# Altium schematic sheet IDD_measurement.SchDoc: IDD measurement / MFX (Multi Function eXpander)
size A3; Date: 3/31/2015; Author: P.A.; CompanyName: STMicroelectronics; Organization: Microcontrollers Division; Address1: 12, Rue Jules HOROWITZ; Address2: 38019 Grenoble; Address3: FRANCE; DocumentNumber: MB1261; Revision: B.01; SheetNumber: 10; SheetTotal: 15; Project: STM32L496G-DISCO
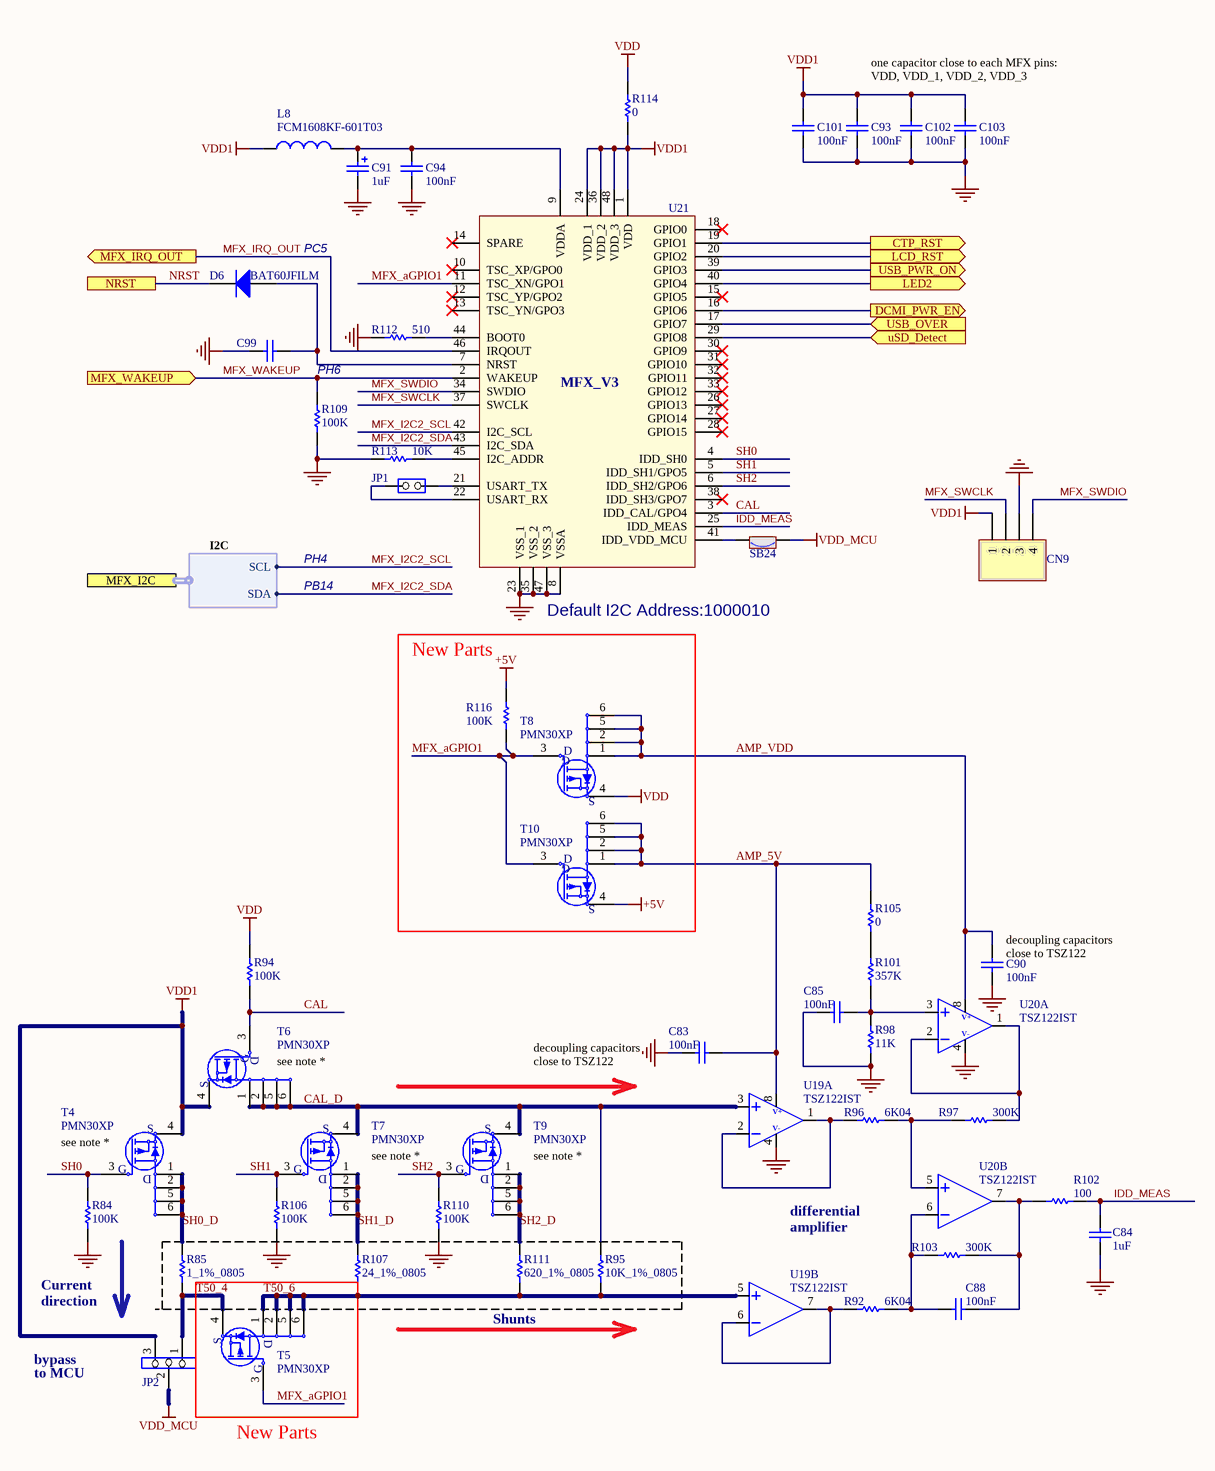
[diagram p0: IDD_measurement.SchDoc]

## Parts
C83  value 100nF  [0603C]  (hidden comment: CC0603KRX7R7BB104)
C84  value 1uF  [0603C]  (hidden comment: CC0603KRX5R7BB105)
C85  value 100nF  [0603C]  (hidden comment: CC0603KRX7R7BB104)
C88  value 100nF  [0603C]  (hidden comment: CC0603KRX7R7BB104)
C90  value 100nF  [0603C]  (hidden comment: CC0603KRX7R7BB104)
C91  value 1uF  [TAN-A]  (hidden comment: TAJA105K016R)
C93  value 100nF  [0603C]  (hidden comment: CC0603KRX7R7BB104)
C94  value 100nF  [0603C]  (hidden comment: CC0603KRX7R7BB104)
C99  (no value)  [0603C]
C101  value 100nF  [0603C]  (hidden comment: CC0603KRX7R7BB104)
C102  value 100nF  [0603C]  (hidden comment: CC0603KRX7R7BB104)
C103  value 100nF  [0603C]  (hidden comment: CC0603KRX7R7BB104)
CN9  (no value)  [HDR_1X4_2R54]
D6  BAT60JFILM  [SOD-323]
JP1  (no value)  [SIP2]
JP2  3 PIN Jumper  [SIP3]  (value not drawn)
L8  FCM1608KF-601T03  [0603L]
R84  value 100K  [0603R]  (hidden comment: RC0603FR-07100KL)
R85  1_1%_0805  [0805R]
R92  value 6K04  [0603R]  (hidden comment: RC0603FR-076K04L)
R94  value 100K  [0603R]  (hidden comment: RC0603FR-07100KL)
R95  10K_1%_0805  [0805R]
R96  value 6K04  [0603R]  (hidden comment: RC0603FR-076K04L)
R97  value 300K  [0603R]  (hidden comment: RC0603FR-07300KL)
R98  value 11K  [0603R]  (hidden comment: RC0603FR-0711KL)
R101  value 357K  [0603R]  (hidden comment: RC0603FR-07357KL)
R102  value 100  [0603R]  (hidden comment: RC0603JR-07100RL)
R103  value 300K  [0603R]  (hidden comment: RC0603FR-07300KL)
R105  value 0  [0603R]  (hidden comment: RC0603JR-070RL)
R106  value 100K  [0603R]  (hidden comment: RC0603FR-07100KL)
R107  24_1%_0805  [0805R]
R109  value 100K  [0603R]  (hidden comment: RC0603FR-07100KL)
R110  value 100K  [0603R]  (hidden comment: RC0603FR-07100KL)
R111  620_1%_0805  [0805R]
R112  value 510  [0603R]  (hidden comment: RC0603FR-07510RL)
R113  value 10K  [0603R]  (hidden comment: RC0603FR-0710KL)
R114  value 0  [0603R]  (hidden comment: RC0603JR-070RL)
R116  value 100K  [0603R]  (hidden comment: RC0603FR-07100KL)
SB24  Solder Bridge ON  [SB_0603]  (value not drawn)
T4  PMN30XP  [MOS_SOT23-6L]
T5  PMN30XP  [MOS_SOT23-6L]
T6  PMN30XP  [MOS_SOT23-6L]
T7  PMN30XP  [MOS_SOT23-6L]
T8  PMN30XP  [MOS_SOT23-6L]
T9  PMN30XP  [MOS_SOT23-6L]
T10  PMN30XP  [MOS_SOT23-6L]
U19  TSZ122IST  [miniSO8]  (parts A,B of 2)
U20  TSZ122IST  [miniSO8]  (parts A,B of 2)
U21  STM32L152CCT6  [LQFP48_0R5_9X9]  (value not drawn)

## Blocks framed on the sheet
New Parts: R116 T8 T10

## Ports
CTP_RST (out), DCMI_PWR_EN (out), LCD_RST (out), LED2 (out), MFX_I2C (harness I2C), MFX_IRQ_OUT (out), MFX_WAKEUP (in), NRST, USB_OVER (in), USB_PWR_ON (out), uSD_Detect (in)

## Harnesses
I2C: SDA, SCL

## Nets
+5V: R116.2 T10.4(S)
GND: C83.1 C84.2 C85.1 C90.2 C91.2 C93.2 C94.2 C99.1 C101.2 C102.2 C103.2 CN9.3 R84.1 R98.2 R106.1 R109.1 R110.1 R112.2 R113.2 U19.4 U20.4 U21.8(VSSA) U21.23(VSS_1) U21.35(VSS_2) U21.47(VSS_3)
VDD: R94.2 R114.1 T8.4(S)
VDD1: C93.1 C101.1 C102.1 C103.1 CN9.1 JP2.3 L8.1 R114.2 T4.4(S) T6.4(S) U21.1(VDD) U21.24(VDD_1) U21.36(VDD_2) U21.48(VDD_3)
VDD_MCU: JP2.2 SB24.1
AMP_5V: C83.2 R105.2 T10.1(S) T10.2(S) T10.5(D) T10.6(D) U19.8
AMP_VDD: C90.1 T8.1(S) T8.2(S) T8.5(D) T8.6(D) U20.8
CAL: R94.1 T6.3(G) U21.3(IDD_CAL/GPO4)
CAL_D: R95.2 T6.1(S) T6.2(S) T6.5(D) T6.6(D) T7.4(S) T9.4(S) U19.3
CTP_RST: U21.19(GPIO1) ; port CTP_RST
DCMI_PWR_EN: U21.16(GPIO6) ; port DCMI_PWR_EN
IDD_MEAS: C84.1 R102.1 U21.25(IDD_MEAS)
LCD_RST: U21.20(GPIO2) ; port LCD_RST
LED2: U21.40(GPIO4) ; port LED2
MFX_aGPIO1: R116.1 T5.3(G) T8.3(G) T10.3(G) U21.11(TSC_XN/GPO1)
MFX_I2C2_SCL: U21.42(I2C_SCL) ; port MFX_I2C.SCL
MFX_I2C2_SDA: U21.43(I2C_SDA) ; port MFX_I2C.SDA
MFX_IRQ_OUT: U21.46(IRQOUT) ; port MFX_IRQ_OUT
MFX_SWCLK: CN9.2 U21.37(SWCLK)
MFX_SWDIO: CN9.4 U21.34(SWDIO)
MFX_WAKEUP: R109.2 U21.2(WAKEUP) ; port MFX_WAKEUP
NRST: D6.2(K) ; port NRST
SH0: R84.2 T4.3(G) U21.4(IDD_SH0)
SH0_D: R85.2 T4.1(S) T4.2(S) T4.5(D) T4.6(D)
SH1: R106.2 T7.3(G) U21.5(IDD_SH1/GPO5)
SH1_D: R107.2 T7.1(S) T7.2(S) T7.5(D) T7.6(D)
SH2: R110.2 T9.3(G) U21.6(IDD_SH2/GPO6)
SH2_D: R111.2 T9.1(S) T9.2(S) T9.5(D) T9.6(D)
T50_4: JP2.1 R85.1 T5.4(S)
T50_6: R95.1 R107.1 R111.1 T5.1(S) T5.2(S) T5.5(D) T5.6(D) U19.5
USB_OVER: U21.17(GPIO7) ; port USB_OVER
USB_PWR_ON: U21.39(GPIO3) ; port USB_PWR_ON
uSD_Detect: U21.29(GPIO8) ; port uSD_Detect
NetC85_2: C85.2 R98.1 R101.2 U20.3
NetC88_1: C88.1 R92.1 R103.1 U20.6
NetC88_2: C88.2 R102.2 R103.2 U20.7
NetC91_1: C91.1 C94.1 L8.2 U21.9(VDDA)
NetC99_2: C99.2 D6.1(A) U21.7(NRST)
NetJP1_1: JP1.1(COMMON) U21.22(USART_RX)
NetJP1_2: JP1.2(NO) U21.21(USART_TX)
NetR92_2: R92.2 U19.6 U19.7
NetR96_1: R96.1 R97.1 U20.5
NetR96_2: R96.2 U19.1 U19.2
NetR97_2: R97.2 U20.1 U20.2
NetR101_1: R101.1 R105.1
NetR112_1: R112.1 U21.44(BOOT0)
NetR113_1: R113.1 U21.45(I2C_ADDR)
NetSB24_2: SB24.2 U21.41(IDD_VDD_MCU)

Not connected (* = marked no-connect by the designer): U21 10(TSC_XP/GPO0)* 12(TSC_YP/GPO2)* 13(TSC_YN/GPO3)* 14(SPARE)* 15(GPIO5)* 18(GPIO0)* 26(GPIO13)* 27(GPIO14)* 28(GPIO15)* 30(GPIO9)* 31(GPIO10)* 32(GPIO11)* 33(GPIO12)* 38(IDD_SH3/GPO7)*

## Notes on the sheet
- one capacitor close to each MFX pins: VDD, VDD_1, VDD_2, VDD_3
- PC5
- PH6
- PB14
- PH4
- (near U21) Default I2C Address:1000010
- (near C90) decoupling capacitors
  close to TSZ122
- (near T6) see note *
- (near C83) decoupling capacitors
  close to TSZ122
- (near T4) see note *
- see note *
- (near T9) see note *
- differential
  amplifier
- Current direction
- Shunts
- to MCU
- bypass
- New Parts
- Title:
- Project:
- Size:
- Revision:
- Variant:
- A3
- -
- Date:
- Reference:
- Sheet:
- of
- (in symbol MFX) MFX_V3
- (in symbol TSZ122IST, part A) V+; V-

## Library data of the parts
C83 C85 C88 C90 C93 C94 C101-C103 = Cap: Capacitor,100nF,10%,16V,X7R,0603,YAGEO; Ordered by: Subcon; Published: 8-Jun-2000; Revision: July-2002: Re-released for DXP Platform.; Publisher: Altium Limited; Manuf_1: YAGEO; Manuf_Part_1: CC0603KRX7R7BB104
C84 = Cap: Capacitor,1uF,0603,16V,10%,X5R,YAGEO; Ordered by: Subcon; Published: 8-Jun-2000; Revision: July-2002: Re-released for DXP Platform.; Publisher: Altium Limited; Manuf_1: YAGEO; Manuf_Part_1: CC0603KRX5R7BB105
C91 = Cap Pol1: Tan Capacitor,1uF,10%,16V,Tan-A,TAJA105K016R; Manuf_1: AVX; Ordered by: Subcon; ECCN_US/EU: NA; Published: 8-Jun-2000; Revision: July-2002: Re-released for DXP Platform.; Publisher: Altium Limited; Manuf_Part_1: TAJA105K016R
C99 = Cap: Capacitor,100nF,10%,16V,X7R,0603,YAGEO; Manuf_Part_1: CC0603KRX7R7BB104; Ordered by: Subcon; Published: 8-Jun-2000; Revision: July-2002: Re-released for DXP Platform.; Publisher: Altium Limited; Value: 100nF; Manuf_1: YAGEO
CN9 = Header 4: Header, 4-Pin; ECCN_US/EU: [N/A]; Ordered by: Subcon; Revision: 17-Jul-2002: Re-released for DXP Platform.; Publisher: Altium Limited; SOFER_FP: HDR_1X4_2R54
D6 = BAT60JFILM: Provided: STM; ECCN_US/EU: EAR99/NEC; Ref St: 9151097; Revision: July-2002: Re-released for DXP Platform.; Order: BAT60JFILM; Manuf_Part_1: BAT60JFILM; Manuf_1: STM; Distrib: ST; Ordered by: STM
JP1 = JP2: 2 PIN Jumper; Manuf_1: lyconn; Manuf_Part_1: 313102S111116; Ordered by: Subcon; Assembly: with jumper; ECCN_US/EU: [N/A]
JP2 = Jumper3: Jumper 3 pins; Manuf_1: lyconn; Manuf_Part_1: 313103S111116; Ordered by: Subcon; ECCN_US/EU: n/a
L8 = BEAD_600R_350MA_0603: Bead,600R,350mA,0603,FCM1608KF-601T03,Tai-tech; Manuf_2: TDK; Manuf_Part_2: MPZ1608S300A; Value: 100uH; Comment_1: bead,30R,5A,0603,MPZ1608S300A,TDK; Ordered by: Subcon; Revision: July-2002: Re-released for DXP Platform.; Manuf_Part_1: FCM1608KF-601T03; Order: FCM1608KF-601T03; Manuf_1: Tai-tech
R84 R94 R106 R109 R110 R116 = res1: Resistor,100K,0603,1%,YAGEO; Ordered by: Subcon; ECCN_US/EU: NA; Published: 8-Jun-2000; Revision: July-2002: Re-released for DXP Platform.; Publisher: Altium Limited; Manuf_1: YAGEO; Manuf_Part_1: RC0603FR-07100KL
R85 = Res_1_1%_0805: Resistor,1,0805,1%,YAGEO; Manuf_Part_1: RC0805FR-071RL; Value: 1; Ordered by: Subcon; Manuf_1: YAGEO; Order: RC0805FR-071RL; ECCN_US/EU: n/a
R92 R96 = res1: Resistor,6.04K,0603,1%,YAGEO; Ordered by: Subcon; ECCN_US/EU: NA; Published: 8-Jun-2000; Revision: July-2002: Re-released for DXP Platform.; Publisher: Altium Limited; Manuf_1: YAGEO; Manuf_Part_1: RC0603FR-076K04L
R95 = Res_10K_1%_0805: Resistor,10K,0805,1%,YAGEO; Manuf_Part_1: RC0805FR-0710KL; Ordered by: Subcon; Value: 10K; Manuf_1: YAGEO; Order: RC0805FR-0710KL; ECCN_US/EU: n/a
R97 R103 = res1: Resistor,300K,0603,1%,YAGEO; Ordered by: Subcon; ECCN_US/EU: NA; Published: 8-Jun-2000; Revision: July-2002: Re-released for DXP Platform.; Publisher: Altium Limited; Manuf_1: YAGEO; Manuf_Part_1: RC0603FR-07300KL
R98 = res1: Resistor,11K,0603,1%,YAGEO; Ordered by: Subcon; ECCN_US/EU: NA; Published: 8-Jun-2000; Revision: July-2002: Re-released for DXP Platform.; Publisher: Altium Limited; Manuf_1: YAGEO; Manuf_Part_1: RC0603FR-0711KL
R101 = res1: Resistor,357K,0603,1%,YAGEO; Ordered by: Subcon; ECCN_US/EU: NA; Published: 8-Jun-2000; Revision: July-2002: Re-released for DXP Platform.; Publisher: Altium Limited; Manuf_1: YAGEO; Manuf_Part_1: RC0603FR-07357KL
R102 = res1: Resistor, 100 ,0603,1%,YAGEO; Ordered by: Subcon; ECCN_US/EU: NA; Published: 8-Jun-2000; Revision: July-2002: Re-released for DXP Platform.; Publisher: Altium Limited; Manuf_1: YAGEO; Manuf_Part_1: RC0603JR-07100RL
R105 R114 = res1: Resistor, 0 ,0603,1%,YAGEO; Ordered by: Subcon; ECCN_US/EU: NA; Published: 8-Jun-2000; Revision: July-2002: Re-released for DXP Platform.; Publisher: Altium Limited; Manuf_1: YAGEO; Manuf_Part_1: RC0603JR-070RL
R107 = Res_24_1%_0805: Resistor,24,0805,1%,YAGEO; Manuf_Part_1: RC0805FR-0724RL; Value: 24; Ordered by: Subcon; Manuf_1: YAGEO; Order: RC0805FR-0724RL; ECCN_US/EU: n/a
R111 = Res_620_1%_0805: Resistor,620,0805,1%,YAGEO; Manuf_Part_1: RC0805FR-07620RL; Value: 620; Ordered by: Subcon; Manuf_1: YAGEO; Order: RC0805FR-07620RL; ECCN_US/EU: n/a
R112 = res1: Resistor,510R,0603,1%,YAGEO; Ordered by: Subcon; ECCN_US/EU: NA; Published: 8-Jun-2000; Revision: July-2002: Re-released for DXP Platform.; Publisher: Altium Limited; Manuf_1: YAGEO; Manuf_Part_1: RC0603FR-07510RL
R113 = res1: Resistor,10K,0603,1%,YAGEO; Ordered by: Subcon; ECCN_US/EU: NA; Published: 8-Jun-2000; Revision: July-2002: Re-released for DXP Platform.; Publisher: Altium Limited; Manuf_1: YAGEO; Manuf_Part_1: RC0603FR-0710KL
SB24 = SB_ON: Manuf_1: YAGEO; Manuf_Part_1: RC0603JR-070RL; Solder: YES; Ordered By: Subcon; Revision: July-2002: Re-released for DXP Platform.; ECCN_US/EU: N/A
T4-T10 = MCD-01926: 20 V, P-channel Trench MOSFET; Part_Type: IC; Part_Preference: Recommended; Manufacturer: NEXPERIA; Order_Code_RS: 153-0671; Internal_Part_Number: MCD-01926; Value: PMN30XP; Status: Checked; Manufacturer_Part_Number: PMN30XP; Alternate_Manufacturer: N/A; Alternate_Manufacturer_Part_Number: N/A; Package: TSOP6; ComponentLink1URL: http://tunmcdsvn.tun.st.com/Component_Datasheet_Library/Trunk/IC/NEXPERIA_P_Channel_MOSFET_PMN30XP; Order_Code_Digikey: 1727-2699-1-ND; Order_Code_Farnell: 2545273
U19 U20 = TSZ122IST: Very high accuracy (5 礦) zero drift 5 V dual OpAmp; Manuf_1: STM; ECCN_US/EU: EAR99/NEC; Provided: ST; Ref St: xxxxxxxxx; Manuf_Part_1: TSZ122IST; Distrib: ST; Order: TSZ122IST; Ordered by: STM
U21 = MFX: Multifunction expander; Manuf_1: STM; Manuf_Part_1: STM32L152CCT6; Ordered by: STM